# EAGLE design DUT-28bit-preCounter (EAGLE 5.07)
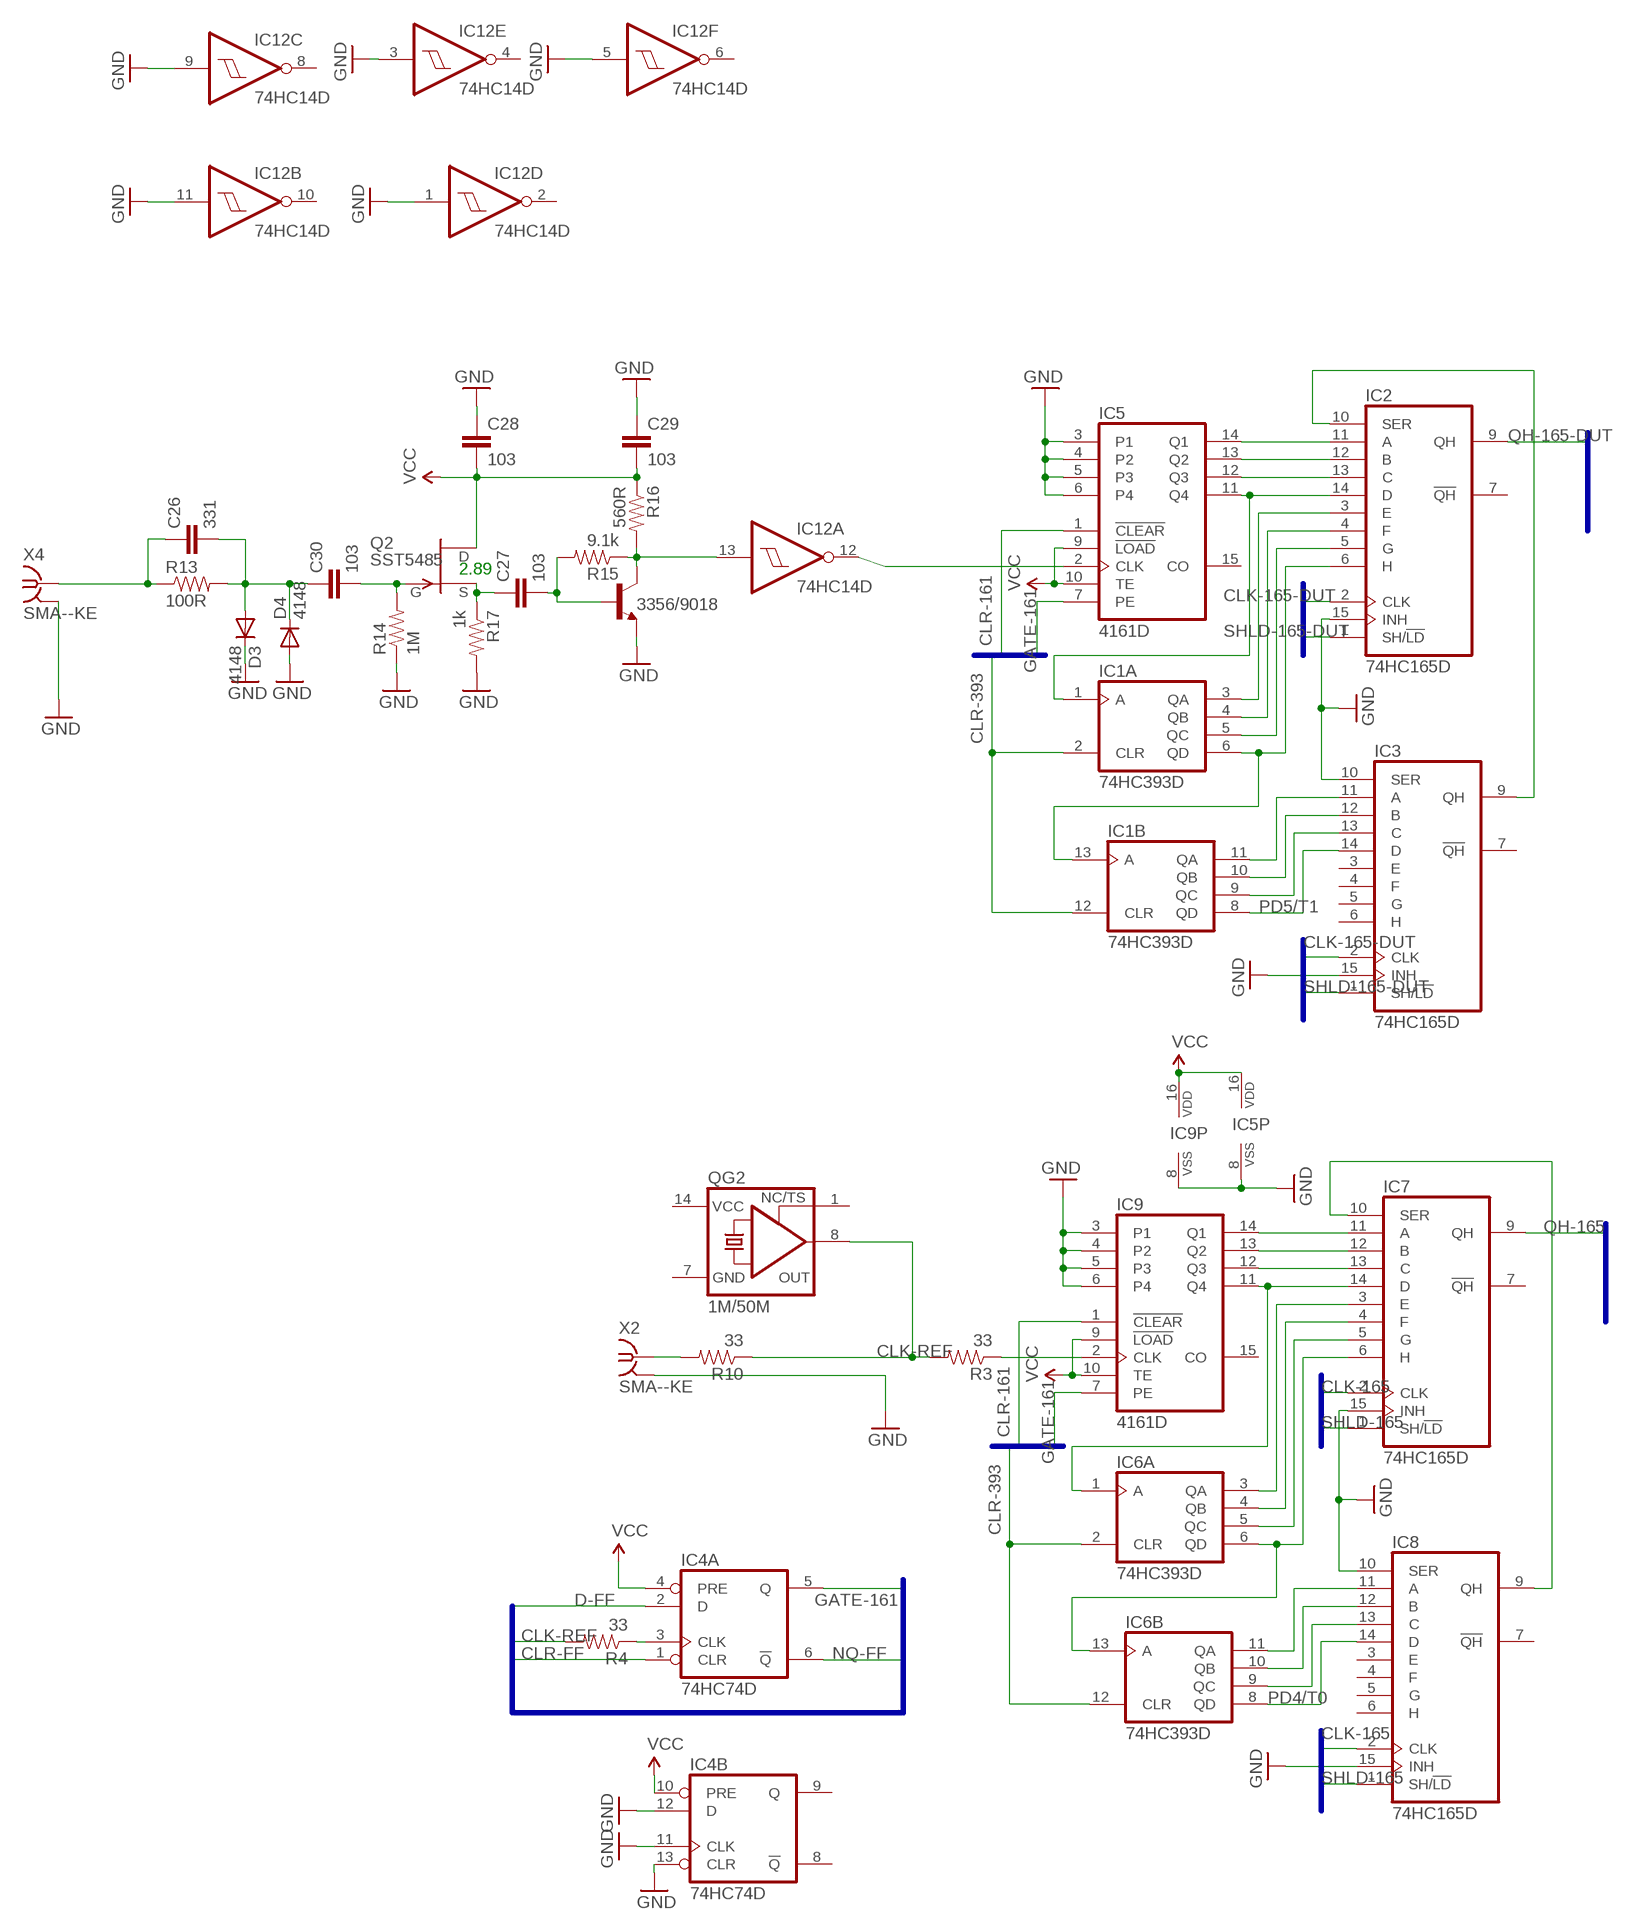
[diagram p0: schematic, sheet 1, part 1 of 2]
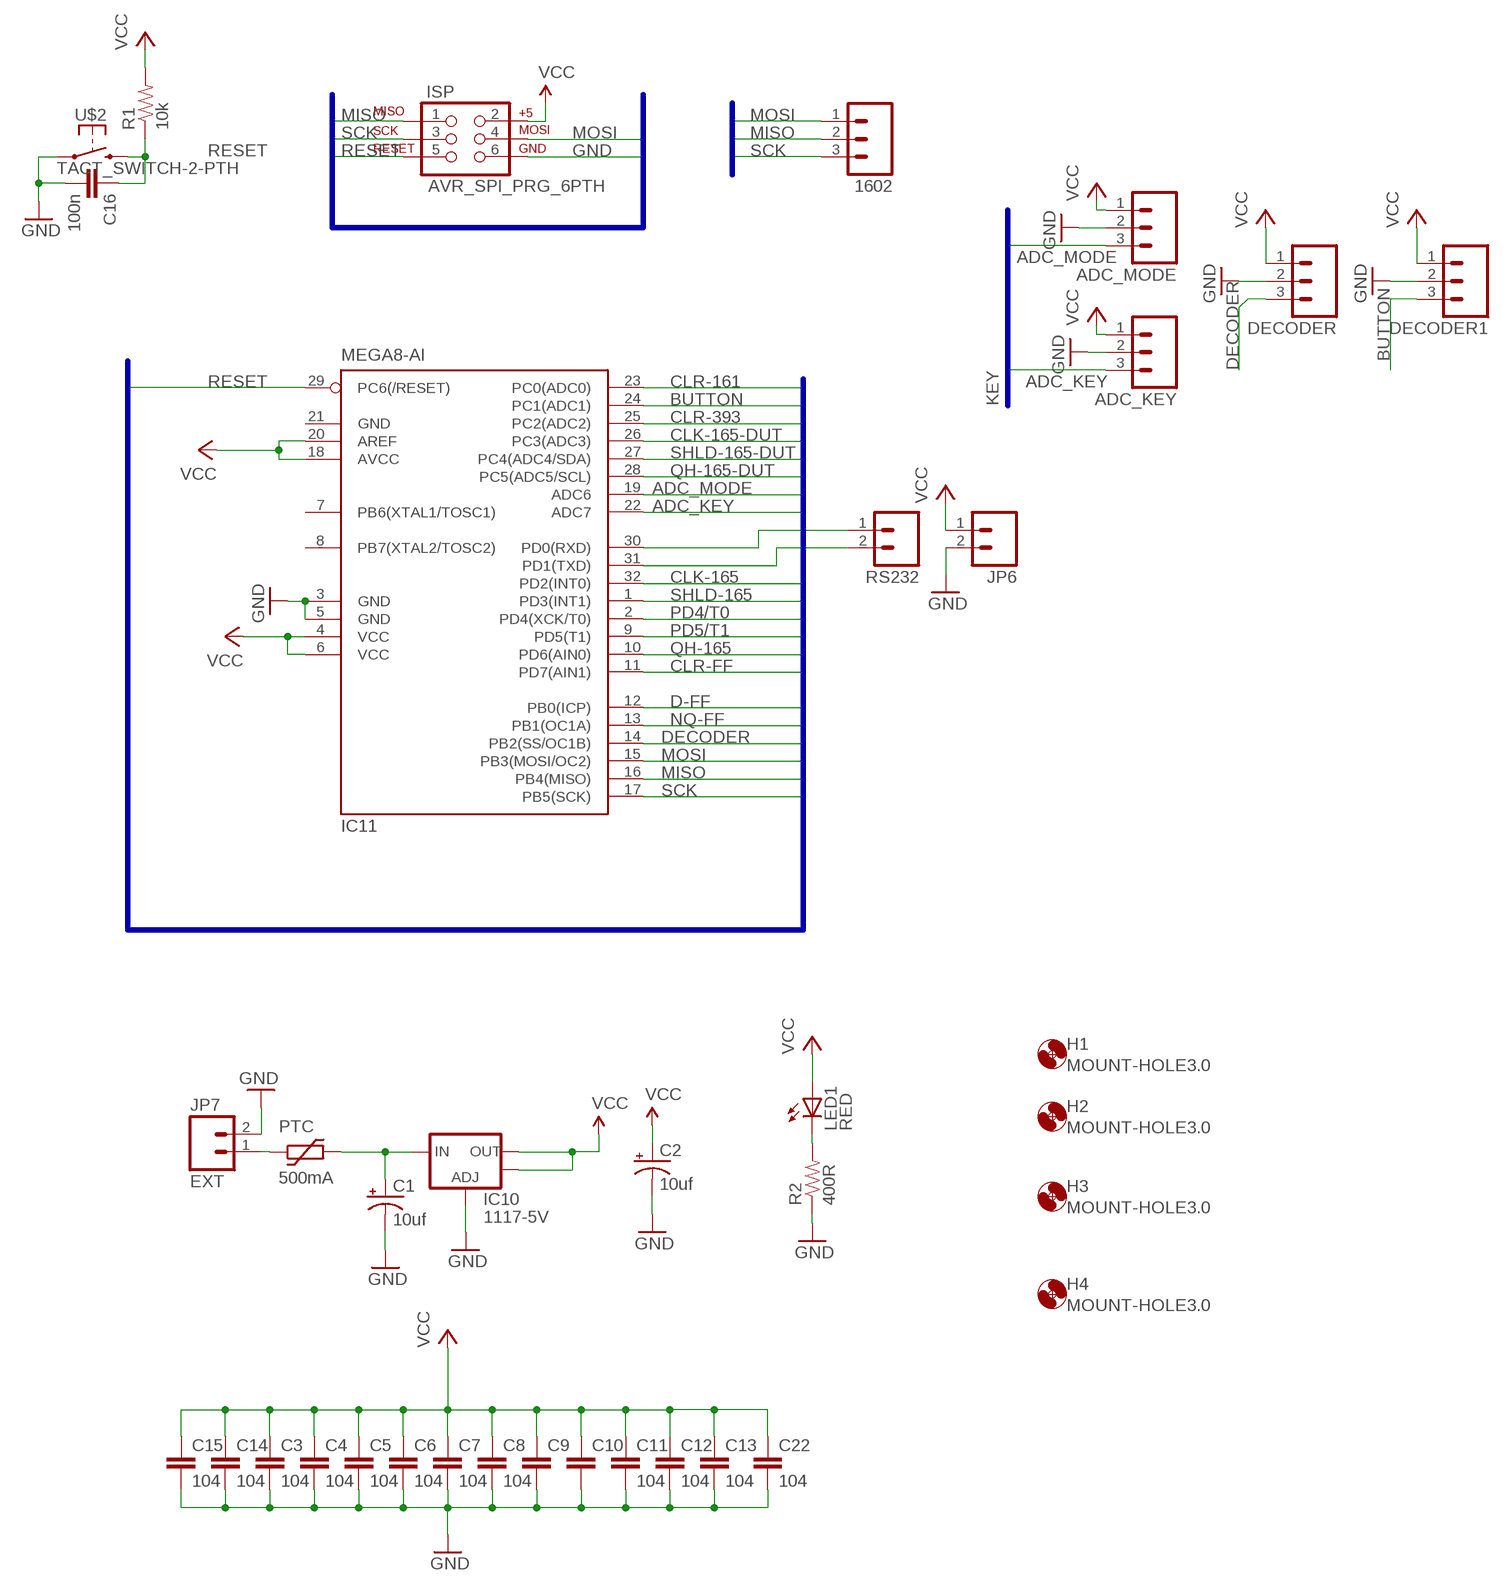
[diagram p1: schematic, sheet 1, part 2 of 2]

## Parts
1602  M03LOCK_LONGPADS  [1X03_LOCK_LONGPADS]
3356/9018  -NPN-SOT23-BEC  [SOT23-BEC]
ADC_KEY  M03PTH  [1X03]
ADC_MODE  M03PTH  [1X03]
C1  10uf  CAP_POL7343  [EIA7343]
C2  10uf  CAP_POL7343  [EIA7343]
C3  104  CAP-C0805K  [C0805K]
C4  104  CAP-C0805K  [C0805K]
C5  104  CAP-C0805K  [C0805K]
C6  104  CAP-C0805K  [C0805K]
C7  104  CAP-C0805K  [C0805K]
C8  104  CAP-C0805K  [C0805K]
C9  CAP-C0805K  [C0805K]
C10  CAP-C0805K  [C0805K]
C11  104  CAP-C0805K  [C0805K]
C12  104  CAP-C0805K  [C0805K]
C13  104  CAP-C0805K  [C0805K]
C14  104  CAP-C0805K  [C0805K]
C15  104  CAP-C0805K  [C0805K]
C16  100n  CAP-C0805K  [C0805K]
C22  104  CAP-C0805K  [C0805K]
C26  331  CAP-C0805  [C0805]
C27  103  CAP-C0805  [C0805]
C28  103  CAP-C0805  [C0805]
C29  103  CAP-C0805  [C0805]
C30  103  CAP-C0805  [C0805]
D3  4148  DIODE1206  [1206-DIODE]
D4  4148  DIODE1206  [1206-DIODE]
DECODER  M03PTH  [1X03]
DECODER1  M03PTH  [1X03]
H1  MOUNT-HOLE3.0  [3,0]
H2  MOUNT-HOLE3.0  [3,0]
H3  MOUNT-HOLE3.0  [3,0]
H4  MOUNT-HOLE3.0  [3,0]
IC1  74HC393D  [SO14]
IC2  74HC165D  [SO16]
IC3  74HC165D  [SO16]
IC4  74HC74D  [SO14]
IC5  4161D  [SO16]
IC6  74HC393D  [SO14]
IC7  74HC165D  [SO16]
IC8  74HC165D  [SO16]
IC9  4161D  [SO16]
IC10  1117-5V  V_REG_LM1117SOT223  [SOT223]
IC11  MEGA8-AI  [TQFP32-08]
IC12  74HC14D  [SO14]
ISP  AVR_SPI_PRG_6PTH  [2X3]
JP6  CON-02PTH  [1X02]
JP7  EXT  CON-02-XH  [XH-1X2-LONG-LOCK]
LED1  RED  LEDCHIP-LED0805  [CHIP-LED0805]
PTC  500mA  PTC-FUSE1812L  [1812L]
Q2  SST5485  [SOT23]
QG2  1M/50M  XO-14  [DIL14S]
R1  10k  RESISTOR0805  [0805]
R2  400R  RESISTOR0805  [0805]
R3  33  RESISTOR0805  [0805]
R4  33  RESISTOR0805  [0805]
R10  33  RESISTOR0805  [0805]
R13  100R  RESISTOR0805  [0805]
R14  1M  RESISTOR-R0805W  [R0805W]
R15  9.1k  RESISTOR0805  [0805]
R16  560R  RESISTOR-R0805W  [R0805W]
R17  1k  RESISTOR-R0805W  [R0805W]
RS232  CON-02PTH  [1X02]
U$2  TACT_SWITCH-2-PTH  [ALPS-SKHV]
X2  SMA--KE  [SMA-KE]
X4  SMA--KE  [SMA-KE]

## Nets
ADC_KEY: ADC_KEY.3 IC11.22(ADC7)
ADC_MODE: ADC_MODE.3 IC11.19(ADC6)
BUTTON: DECODER1.3 IC11.24(PC1(ADC1))
CLK-165: IC7.2(CLK) IC8.2(CLK) IC11.32(PD2(INT0))
CLK-165-DUT: IC2.2(CLK) IC3.2(CLK) IC11.26(PC3(ADC3))
CLK-REF: QG2.8(OUT) R3.2 R4.2 R10.1
CLR-161: IC5.1(!CLEAR) IC9.1(!CLEAR) IC11.23(PC0(ADC0))
CLR-393: IC1.2(A:CLR) IC1.12(B:CLR) IC6.2(A:CLR) IC6.12(B:CLR) IC11.25(PC2(ADC2))
CLR-FF: IC4.1(A:CLR) IC11.11(PD7(AIN1))
D-FF: IC4.2(A:D) IC11.12(PB0(ICP))
DECODER: DECODER.3 IC11.14(PB2(SS/OC1B))
GATE-161: IC4.5(A:Q) IC5.7(PE) IC9.7(PE)
GND: 3356/9018.E ADC_KEY.2 ADC_MODE.2 C1.C(-) C2.C(-) C3.2 C4.2 C5.2 C6.2 C7.2 C8.2 C9.2 C10.2 C11.2 C12.2 C13.2 C14.2 C15.2 C16.2 C22.2 C28.1 C29.1 D3.K(C) D4.A DECODER1.2 DECODER.2 IC2.15(INH) IC3.10(SER) IC3.15(INH) IC4.11(B:CLK) IC4.12(B:D) IC4.13(B:CLR) IC5.3(P1) IC5.4(P2) IC5.5(P3) IC5.6(P4) IC5.8(VSS) IC7.15(INH) IC8.10(SER) IC8.15(INH) IC9.3(P1) IC9.4(P2) IC9.5(P3) IC9.6(P4) IC9.8(VSS) IC10.1(ADJ) IC11.3(GND) IC11.5(GND) IC12.1(D:I) IC12.3(E:I) IC12.5(F:I) IC12.9(C:I) IC12.11(B:I) ISP.6 JP6.2 JP7.2 R2.1 R14.1 R17.2 U$2.2 X2.G@1(GND) X4.G@1(GND)
MISO: 1602.2 IC11.16(PB4(MISO)) ISP.1
MOSI: 1602.1 IC11.15(PB3(MOSI/OC2)) ISP.4
N$1: IC2.11(A) IC5.14(Q1)
N$2: IC2.12(B) IC5.13(Q2)
N$3: IC2.13(C) IC5.12(Q3)
N$4: JP7.1 PTC.P$1
N$5: IC1.3(A:QA) IC2.3(E)
N$6: IC1.4(A:QB) IC2.4(F)
N$7: IC1.5(A:QC) IC2.5(G)
N$8: IC1.6(A:QD) IC1.13(B:A) IC2.6(H)
N$9: IC1.1(A:A) IC2.14(D) IC5.11(Q4)
N$10: IC1.11(B:QA) IC3.11(A)
N$11: IC1.10(B:QB) IC3.12(B)
N$12: IC1.9(B:QC) IC3.13(C)
N$13: IC11.30(PD0(RXD)) RS232.1
N$14: C1.A(+) IC10.3(IN) PTC.P$2
N$15: IC2.10(SER) IC3.9(QH)
N$16: IC7.11(A) IC9.14(Q1)
N$17: IC7.12(B) IC9.13(Q2)
N$18: IC7.13(C) IC9.12(Q3)
N$19: R10.2 X2.1
N$20: IC6.3(A:QA) IC7.3(E)
N$21: IC6.4(A:QB) IC7.4(F)
N$22: IC6.5(A:QC) IC7.5(G)
N$23: IC6.6(A:QD) IC6.13(B:A) IC7.6(H)
N$24: IC6.11(B:QA) IC8.11(A)
N$25: IC6.10(B:QB) IC8.12(B)
N$26: IC6.9(B:QC) IC8.13(C)
N$27: IC11.31(PD1(TXD)) RS232.2
N$28: IC6.1(A:A) IC7.14(D) IC9.11(Q4)
N$29: IC4.3(A:CLK) R4.1
N$30: IC7.10(SER) IC8.9(QH)
N$31: IC9.2(CLK) R3.1
N$32: LED1.C R2.2
N$38: IC5.2(CLK) IC12.12(A:O)
N$41: C26.1 R13.1 X4.1
N$42: C26.2 C30.1 D3.A D4.K(C) R13.2
N$43: C27.1 Q2.2(S) R17.1
N$44: 3356/9018.B C27.2 R15.2
N$45: 3356/9018.C IC12.13(A:I) R15.1 R16.2
N$46: C30.2 Q2.3(G) R14.2
NQ-FF: IC4.6(A:!Q) IC11.13(PB1(OC1A))
PD4/T0: IC6.8(B:QD) IC8.14(D) IC11.2(PD4(XCK/T0))
PD5/T1: IC1.8(B:QD) IC3.14(D) IC11.9(PD5(T1))
QH-165: IC7.9(QH) IC11.10(PD6(AIN0))
QH-165-DUT: IC2.9(QH) IC11.28(PC5(ADC5/SCL))
RESET: C16.1 IC11.29(PC6(/RESET)) ISP.5 R1.1 U$2.3
SCK: 1602.3 IC11.17(PB5(SCK)) ISP.3
SHLD-165: IC7.1(SH/!LD) IC8.1(SH/!LD) IC11.1(PD3(INT1))
SHLD-165-DUT: IC2.1(SH/!LD) IC3.1(SH/!LD) IC11.27(PC4(ADC4/SDA))
VCC: ADC_KEY.1 ADC_MODE.1 C2.A(+) C3.1 C4.1 C5.1 C6.1 C7.1 C8.1 C9.1 C10.1 C11.1 C12.1 C13.1 C14.1 C15.1 C22.1 C28.2 C29.2 DECODER1.1 DECODER.1 IC4.4(A:PRE) IC4.10(B:PRE) IC5.9(!LOAD) IC5.10(TE) IC5.16(VDD) IC9.9(!LOAD) IC9.10(TE) IC9.16(VDD) IC10.2(OUT) IC10.4(OUT) IC11.4(VCC) IC11.6(VCC) IC11.18(AVCC) IC11.20(AREF) ISP.2 JP6.1 LED1.A Q2.1(D) R1.2 R16.1
Unconnected: IC2.7(!QH) IC3.3(E) IC3.4(F) IC3.5(G) IC3.6(H) IC3.7(!QH) IC4.8(B:!Q) IC4.9(B:Q) IC5.15(CO) IC7.7(!QH) IC8.3(E) IC8.4(F) IC8.5(G) IC8.6(H) IC8.7(!QH) IC9.15(CO) IC11.7(PB6(XTAL1/TOSC1)) IC11.8(PB7(XTAL2/TOSC2)) IC12.2(D:O) IC12.4(E:O) IC12.6(F:O) IC12.8(C:O) IC12.10(B:O) QG2.1(TS)

## Buses
MEGA-BUS
KEY

## Notes on the sheet
- 2.89

## Power pins joined to a net without a drawn wire
GND: IC1.7(P:GND) IC2.8(GND) IC3.8(GND) IC4.7(P:GND) IC6.7(P:GND) IC7.8(GND) IC8.8(GND) IC11.21(GND) IC12.7(P:GND) QG2.7(GND) X2.G@2(GND) X2.G@3(GND) X2.G@4(GND) X4.G@2(GND) X4.G@3(GND) X4.G@4(GND)
VCC: IC1.14(P:VCC) IC2.16(VCC) IC3.16(VCC) IC4.14(P:VCC) IC6.14(P:VCC) IC7.16(VCC) IC8.16(VCC) IC12.14(P:VCC) QG2.14(VCC)

## Library data of the parts
1602 ADC_KEY ADC_MODE DECODER DECODER1 = SparkFun:M03: Header 3 Standard 3-pin 0.1" header. Use with straight break away headers (SKU : PRT-00116), right angle break away headers (PRT-00553), swiss pins (PRT-00743), machine pins (PRT-00117), and female headers (PRT-00115). Molex polarized connector foot print use with SKU : PRT-08232 with associated crimp pins and housings.
3356/9018 = digital-toy:*-NPN-: NPN Transistror most of sot-23 use the pacages sot23-BEC, top C, left B, right E. by hyl, digital-toy. and to-92 use ebc(from-top) by hyl, digital-toy.
C1 C2 = digital-toy:CAP_POL: Capacitor Polarized These are standard SMD and PTH capacitors. Normally 10uF, 47uF, and 100uF in electrolytic and tantalum varieties. Always verify the external diameter of the through hole cap, it varies with capacity, voltage, and manufacturer. The EIA devices should be standard. PANASONIC_D size: 6.5mmx6.5mmx5.5mm, 100uf (taobao:6.3mmx5.5mm), same as CVL0605 153cvl0405 size: 4mmx4mmx5.5mm, 10uf (taobao:4mmx5.5mm) ct6032 typical 47uF Tantalum, comment by hyl.
C3-C16 C22 C26-C30 = digital-toy:CAP: Capacitor Standard 0603 ceramic capacitor, and 0.1" leaded capacitor.
D3 D4 = digital-toy:DIODE: Diode These are standard reverse protection diodes and small signal diodes. SMA package can handle up to about 1A. SOD-323 can handle about 200mA. What the SOD-323 package when ordering, there are some mfgs out there that are 5-pin packages.
H1-H4 = holes:MOUNT-HOLE: MOUNTING HOLE with drill center marker
IC1 IC6 = 74xx-eu:74*393: Dual 4-bit decade and binary COUNTER
IC2 IC3 IC7 IC8 = 74xx-eu:74*165: 8-bit parallel load SHIFT REGISTER
IC4 = 74xx-eu:74*74: Dual D type positive edge triggered FLIP FLOP, preset and clear
IC5 IC9 = 40xx:4161: Synchronous presettable 4-bit binary COUNTER
IC10 = SparkFun:V_REG_LM1117: Voltage Regulator LM1117 Standard adjustable voltage regulator but in SMD form. Spark Fun Electronics SKU : COM-00595
IC11 = atmel:MEGA8: MICROCONTROLLER 8 Kbytes FLASH, 1 kbytes SRAM, 512 bytes EEPROM, USART, 6-channel 10 bit ADC, 2-channel 8 bit ADC Pin compatible with Atmega48, ATMega88, ATMega168 Source: avr.lbr
IC12 = 74xx-eu:74*14: Hex schmitt trigger INVERTER
ISP = SparkFun:AVR_SPI_PRG_6: AVR ISP 6 Pin This is the reduced ISP connector for AVR programming. Common on Arduino. This footprint will take up less PCB space and can be used with a 10-pin to 6-pin adapter such as SKU: BOB-08508
JP6 JP7 RS232 = digital-toy:CON-02: Header 2 Standard 2-pin 0.1" header. Use with straight break away headers (SKU : PRT-00116), right angle break away headers (PRT-00553), swiss pins (PRT-00743), machine pins (PRT-00117), and female headers (PRT-00115). Molex polarized connector foot print use with SKU : PRT-08233 with associated crimp pins and housings.
LED1 = led:LED: LED OSRAM: - CHIPLED LG R971, LG N971, LY N971, LG Q971, LY Q971, LO R971, LY R971 LH N974, LH R974 LS Q976, LO Q976, LY Q976 LO Q996 - Hyper CHIPLED LW Q18S LB Q993, LB Q99A, LB R99A - SideLED LS A670, LO A670, LY A670, LG A670, LP A670 LB A673, LV A673, LT A673, LW A673 LH A674 LY A675 LS A676, LA A676, LO A676, LY A676, LW A676 LS A679, LY A679, LG A679 - Hyper Micro SIDELED® LS Y876, LA Y876, LO Y876, LY Y876 LT Y87S - SmartLED LW L88C, LW L88S LB L89C, LB L89S, LG L890 LS L89K, LO L89K, LY L89K LS L896, LA L896, LO L896, LY L896 - TOPLED LS T670, LO T670, LY T670, LG T670, LP T670 LSG T670, LSP T670, LSY T670, LOP T670, LYG T670 LG T671, LOG T671, LSG T671 LB T673, LV T673, LT T673, LW T673 LH T674 LS T676, LA T676, LO T676, LY T676, LB T676, LH T676, LSB T676, LW T676 LB T67C, LV T67C, LT T67C, LS T67K, LO T67K, LY T67K, LW E67C LS E67B, LA E67B, LO E67B, LY E67B, LB E67C, LV E67C, LT E67C LW T67C LS T679, LY T679, LG T679 LS T770, LO T770, LY T770, LG T770, LP T770 LB T773, LV T773, LT T773, LW T773 LH T774 LS E675, LA E675, LY E675, LS T675 LS T776, LA T776, LO T776, LY T776, LB T776 LHGB T686 LT T68C, LB T68C - Hyper Mini TOPLED® LB M676 - Mini TOPLED Santana® LG M470 LS M47K, LO M47K, LY M47K Source: http://www.osram.convergy.de LUXEON: - LUMILED® LXK2-PW12-R00, LXK2-PW12-S00, LXK2-PW14-U00, LXK2-PW14-V00 LXK2-PM12-R00, LXK2-PM12-S00, LXK2-PM14-U00 LXK2-PE12-Q00, LXK2-PE12-R00, LXK2-PE12-S00, LXK2-PE14-T00, LXK2-PE14-U00 LXK2-PB12-K00, LXK2-PB12-L00, LXK2-PB12-M00, LXK2-PB14-N00, LXK2-PB14-P00, LXK2-PB14-Q00 LXK2-PR12-L00, LXK2-PR12-M00, LXK2-PR14-Q00, LXK2-PR14-R00 LXK2-PD12-Q00, LXK2-PD12-R00, LXK2-PD12-S00 LXK2-PH12-R00, LXK2-PH12-S00 LXK2-PL12-P00, LXK2-PL12-Q00, LXK2-PL12-R00 Source: www.luxeon.com KINGBRIGHT: KA-3528ASYC Source: www.kingbright.com
PTC = digital-toy:PTC-FUSE
Q2 = transistor-fet:?548*: N-Channel JFETs Source: VISHAY 2N5484.pdf Compatible: TO92 2N5245 J304 J305 U310 J308 J309 J310 TO72 2N4416 2N4416A 2N3823 2N4351 3N169 3N170 3N171 MFE3002 TO18 2N3796 2N3797 MFE825 Source: Motorola European Master Guide Pacge 3-59
QG2 = digital-toy:XO-: CRYSTAL
R1-R4 R10 R13-R17 = digital-toy:RESISTOR: Resistor Basic schematic elements and footprints for 0603, 1206, and PTH 1/10th watt (small) resistors. digital-toy copy vertical mount of axial-0.3 from rcl.lbr : the 0207/xx
U$2 = digital-toy:TACT_SWITCH-2
X2 X4 = dtoy-RF:SMA-: SMA 50 Ohm End Launch Jack Receptacle - Round Contact Johnson Components Source: www.johnsoncomponents.com .. J502-ND.pdf

## Board
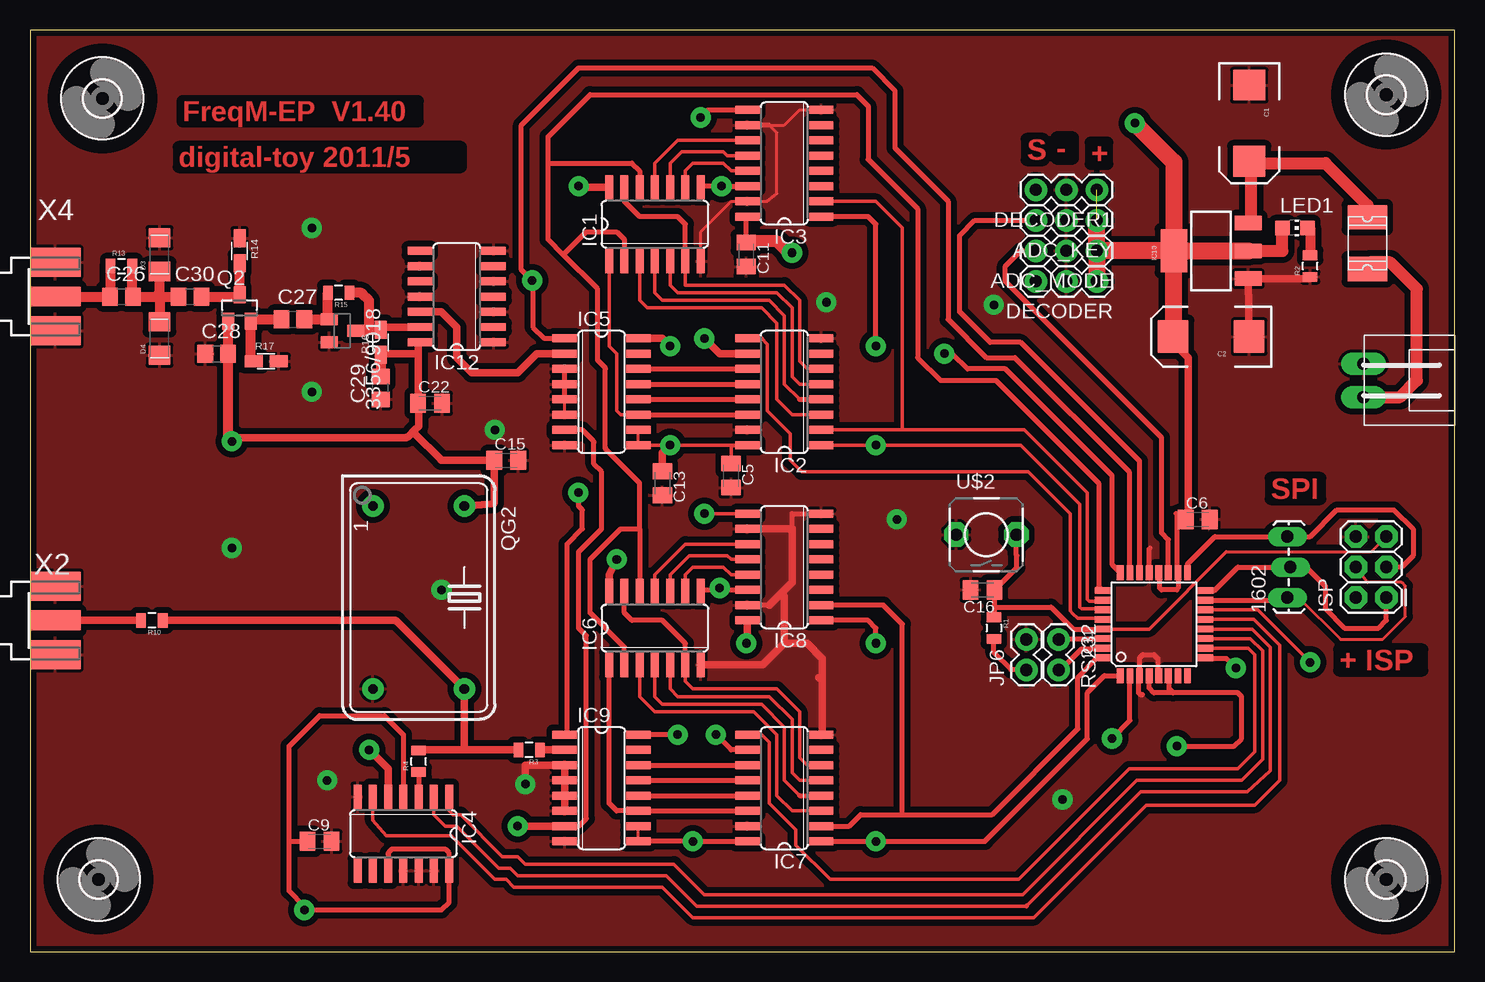
[diagram p2: board, top side]
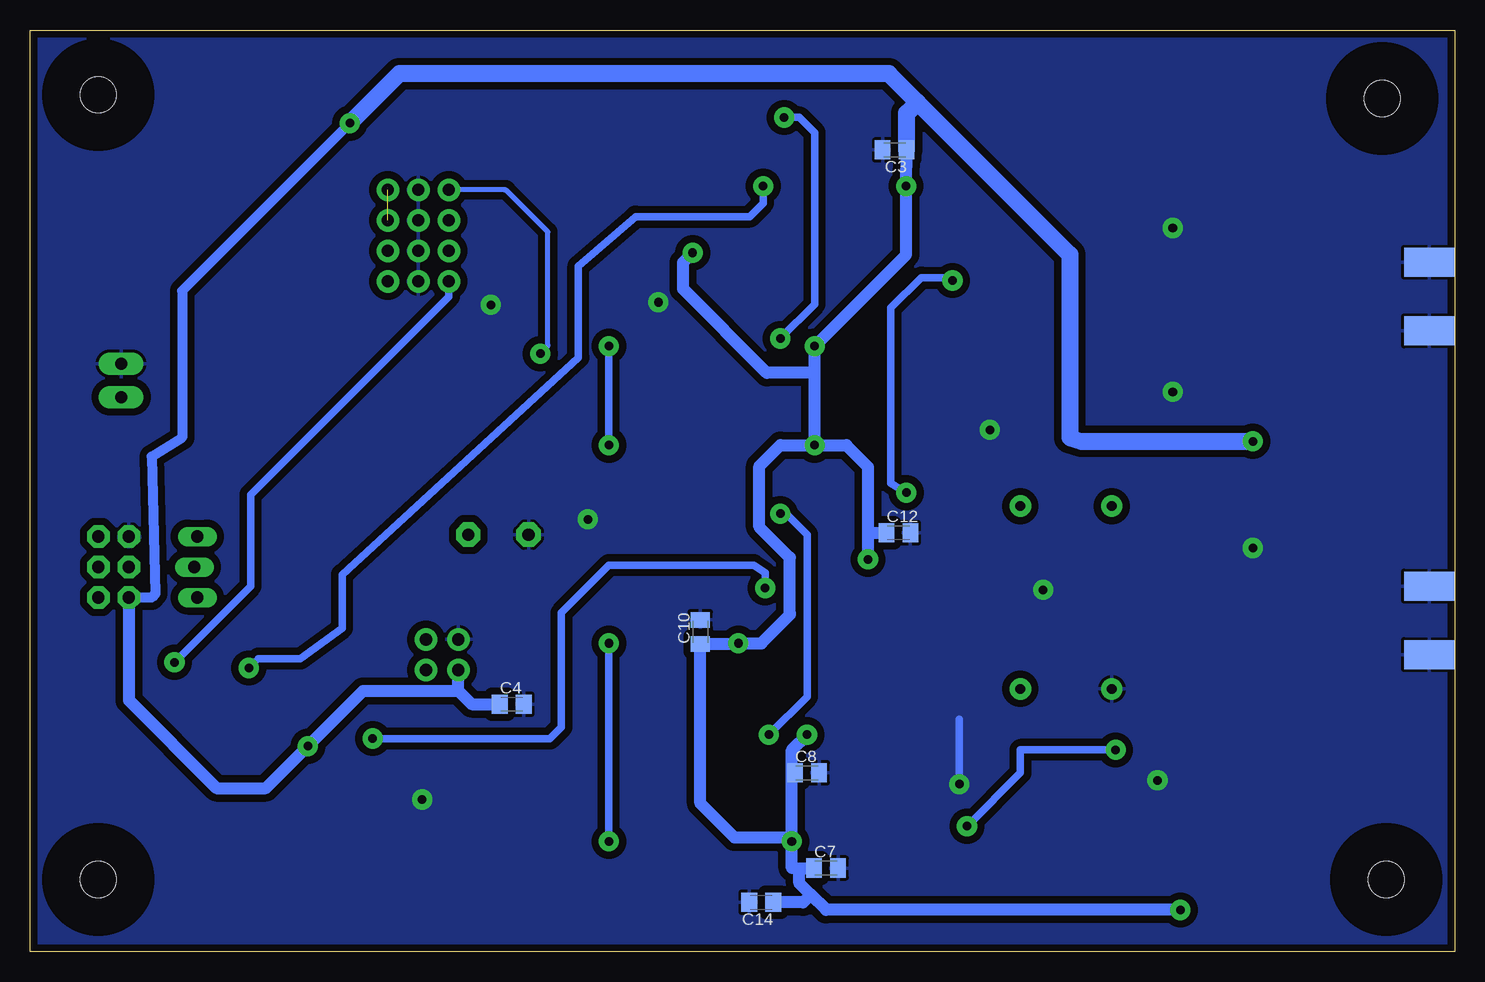
[diagram p3: board, bottom side, seen from below]

Size 118.72 x 76.82 mm. Coordinates in mm from the lower left corner, seen from the top.
Outline: 0,0 118.72,0 118.72,76.82 0,76.82 0,0
Copper layers (1*16): Top 0.035mm / dielectric 1.5mm / Bottom 0.035mm
Design rules "SparkFun": minimum track width 8mil, minimum drill 20mil, track to track 8mil, track to pad 8mil, pad to pad 8mil, via to via 8mil, smd to smd 8mil, copper to edge 10mil, drill to drill 8mil, minimum pad ring 12mil, minimum via ring 10mil, stop-mask expansion 4mil, vias tented up to drill 25mil, thermal gap 10mil

### Footprints (pad centres in the part's own frame; a part is rotated, then mirrored left to right if it is on the bottom)
1X03_LOCK_LONGPADS = drill 1.016 long: 1 0,0; 2 2.54,-0.254; 3 5.08,0
SOT23-BEC = smd 1 x 1.4: B -0.95,-1.1; C 0,1.1; E 0.95,-1.1
1X03 = drill 1.016 pad 1.88 round: 1 0,0; 2 2.54,0; 3 5.08,0
EIA7343 = smd 2.55 x 2.7: A 3.17,0; C -3.17,0
C0805K = smd 1.3 x 1.6: 1 -1,0; 2 1,0
C0805 = smd 1.3 x 1.5: 1 -0.95,0; 2 0.95,0
1206-DIODE = smd 1.6 x 1.8: A -1.4,0; K 1.4,0
3,0 = hole 3: 0,0
SO14 = smd 0.66 x 2.032: 1 -3.81,-3.073; 2 -2.54,-3.073; 3 -1.27,-3.073; 4 0,-3.073; 5 1.27,-3.073; 6 2.54,-3.073; 7 3.81,-3.073; 8 3.81,3.073; 9 2.54,3.073; 10 1.27,3.073; 11 0,3.073; 12 -1.27,3.073; 13 -2.54,3.073; 14 -3.81,3.073
SO16 = smd 0.66 x 2.032: 1 -4.445,-3.073; 2 -3.175,-3.073; 3 -1.905,-3.073; 4 -0.635,-3.073; 5 0.635,-3.073; 6 1.905,-3.073; 7 3.175,-3.073; 8 4.445,-3.073; 9 4.445,3.073; 10 3.175,3.073; 11 1.905,3.073; 12 0.635,3.073; 13 -0.635,3.073; 14 -1.905,3.073; 15 -3.175,3.073; 16 -4.445,3.073
SOT223 = smd 1.219 x 2.235: 1 -2.311,-3.099; 2 0,-3.099; 3 2.311,-3.099 | smd 3.6 x 2.2: 4 0,3.099
TQFP32-08 = smd 1.27 x 0.559: 1 -4.293,2.8; 2 -4.293,2; 3 -4.293,1.2; 4 -4.293,0.4; 5 -4.293,-0.4; 6 -4.293,-1.2; 7 -4.293,-2; 8 -4.293,-2.8; 17 4.293,-2.8; 18 4.293,-2; 19 4.293,-1.2; 20 4.293,-0.4; 21 4.293,0.4; 22 4.293,1.2; 23 4.293,2; 24 4.293,2.8 | smd 0.559 x 1.27: 9 -2.8,-4.293; 10 -2,-4.293; 11 -1.2,-4.293; 12 -0.4,-4.293; 13 0.4,-4.293; 14 1.2,-4.293; 15 2,-4.293; 16 2.8,-4.293; 25 2.8,4.293; 26 2,4.293; 27 1.2,4.293; 28 0.4,4.293; 29 -0.4,4.293; 30 -1.2,4.293; 31 -2,4.293; 32 -2.8,4.293
2X3 = drill 1.016 pad 1.88 octagon: 1 0,0; 2 0,2.54; 3 2.54,0; 4 2.54,2.54; 5 5.08,0; 6 5.08,2.54
1X02 = drill 1.016 pad 1.88 round: 1 0,0; 2 2.54,0
XH-1X2-LONG-LOCK = drill 1.016 pad 1.88 long: 1 1.397,0; 2 -1.397,0
CHIP-LED0805 = smd 1.2 x 1.2: A 0,-1.05; C 0,1.05
1812L = smd 2.03 x 3.3: P$1 -2.16,0; P$2 2.16,0
SOT23 = smd 1 x 1.4: 1 -0.95,-1.1; 2 0.95,-1.1; 3 0,1.1
DIL14S = drill 0.813 pad 1.778 round: 1 -7.62,-3.81; 7 7.62,-3.81; 8 7.62,3.81; 14 -7.62,3.81
0805 = smd 0.8 x 1.2: 1 -0.9,0; 2 0.9,0
R0805W = smd 1.5 x 1: 1 -1.052,0; 2 1.052,0
ALPS-SKHV = drill 1.016 pad 2.032 octagon: 2 -2.51,0; 3 2.51,0
SMA-KE = smd 4.191 x 1.651: 1 2.115,0 | smd 4.191 x 2.413: G@1 2.115,2.86; G@2 2.115,-2.86 | smd 4.191 x 2.413 bottom: G@3 2.115,2.86; G@4 2.115,-2.86

### Placement (x,y rotation side)
1602  104.78,29.53 90 top
3356/9018  26.04,51.75 270 top
ADC_KEY  88.9,60.96 180 top
ADC_MODE  88.9,58.42 180 top
C1  101.6,69.06 270 top
C2  98.43,51.28 180 top
C3  46.67,66.83 180 bottom
C4  78.58,20.64 0 bottom
C5  58.42,39.69 270 top
C6  97.31,36.04 0 top
C7  52.39,6.99 0 bottom
C8  53.98,14.92 0 bottom
C9  24.13,9.21 0 top
C10  62.87,26.67 90 bottom
C11  59.69,58.1 270 top
C12  46.35,34.92 0 bottom
C13  52.7,39.05 270 top
C14  57.78,4.13 180 bottom
C15  39.69,40.96 0 top
C16  79.38,30.16 180 top
C22  33.34,45.72 0 top
C26  7.62,54.61 0 top
C27  21.91,52.7 0 top
C28  15.56,49.85 0 top
C29  29.21,46.99 90 top
C30  13.34,54.61 0 top
D3  10.79,58.1 90 top
D4  10.79,51.12 90 top
DECODER  88.9,55.88 180 top
DECODER1  88.9,63.5 180 top
H1  6.03,71.12 0 top
H2  113.03,6.03 0 top
H3  113.03,71.44 0 top
H4  5.71,6.03 0 top
IC1  52.07,60.64 0 top
IC2  62.87,46.67 90 top
IC3  62.87,65.72 90 top
IC4  31.11,9.84 180 top
IC5  47.62,46.67 270 top
IC6  52.07,26.99 0 top
IC7  62.87,13.65 90 top
IC8  62.87,32.07 90 top
IC9  47.62,13.65 270 top
IC10  98.42,58.42 90 top
IC11  93.66,27.3 90 top
IC12  35.56,54.61 90 top
ISP  113.03,29.53 90 top
JP6  83.03,23.5 90 top
JP7  111.12,47.62 270 top
LED1  105.41,60.33 270 top
PTC  111.44,59.05 90 top
Q2  17.46,53.66 0 top
QG2  32.38,29.53 270 top
R1  80.33,26.99 270 top
R2  106.68,57.15 90 top
R3  41.59,16.83 180 top
R4  32.38,15.88 90 top
R10  10.16,27.62 180 top
R13  7.62,57.15 0 top
R14  17.46,58.42 270 top
R15  25.72,54.93 180 top
R16  29.21,50.8 90 top
R17  19.68,49.21 0 top
RS232  85.72,26.04 270 top
U$2  79.69,34.77 0 top
X2  0,27.62 0 top
X4  0,54.61 0 top

### Tracks (layer width: path | path; a pad name or v marks a point on that pad's centre or on a via)
ADC_KEY
  Top 0.406: IC11.22 92.46,40.89 82.55,50.8 80.01,50.8 77.47,53.34 77.47,59.69 78.74,60.96 ADC_KEY.3
ADC_MODE
  Top 0.406: IC11.19 94.86,34.36 94.3,34.92 94.3,42.86 81.28,55.88 81.28,57.15 82.55,58.42 ADC_MODE.3
BUTTON  (via drill 0.71 pad 1.68)
  Top 0.406: IC11.24 90.24,32.22 arc-45 90.17,32.4 90.17,39.69 81.28,48.58 78.11,48.58 76.91,49.77 arc45 76.73,49.85 v76.2,49.85
  Bottom 0.406: DECODER1.3 79.16,63.5 arc45 78.98,63.43 75.56,60.01 75.56,50.59 arc45 75.64,50.41 v76.2,49.85
CLK-165
  Top 0.406: IC8.2 71.12,28.89 72.71,27.3 72.71,11.43 | IC7.2 68.26,10.48 69.22,11.43 72.71,11.43 | IC11.32 88.96,24.5 87.31,22.86 87.31,18.57 80.17,11.43 72.71,11.43
CLK-165-DUT
  Top 0.254: 89.28,29.21 IC11.26
  Top 0.305: IC3.2 70.48,62.55 72.71,60.33 72.71,43.5 | 89.28,29.21 88.27,29.21 88.11,29.37 88.11,38.26 | IC2.2 72.71,43.5 | 88.11,38.26 | 88.11,38.26 82.87,43.5 72.71,43.5
CLK-REF
  Top 0.61: 36.2,16.83 32.51,16.83 arc45 R4.2 | 36.2,16.83 R3.2 | 36.2,16.83 QG2.8 30.55,27.55 arc45 30.38,27.62 R10.1
CLR-161  (via drill 0.71 pad 1.68)
  Top 0.254: IC9.1 44.55,18.2 | 45.72,38.24 v45.7,38.27
  Top 0.406: 44.55,18.2 44.77,18.1 44.77,33.97 46.04,35.24 46.04,36.83 45.72,37.15 45.72,38.24 | IC5.1 42.86,51.12 41.91,52.07 41.91,55.69 v41.85,55.94 40.96,56.83 40.96,68.9 45.72,73.66 70.17,73.66 72.07,71.75 72.07,66.99 76.52,62.55 76.52,52.7 79.69,49.53 82.07,49.53 91.6,40.01 91.6,31.66 IC11.23
  Bottom 0.406: 42.55,56.2 42.42,56.2
  Bottom 0.61: 42.55,56.2 44.45,56.2 46.99,53.66 46.99,39.05 v45.7,38.27 | 42.42,56.2 v41.85,55.94
CLR-393
  Top 0.406: 50.8,35.24 IC6.12 | 50.8,35.24 50.8,39.05 48.02,41.84 arc-45 47.94,42.02 47.94,48.58 arc45 47.87,48.76 47.31,49.32 47.31,55.24 44.45,58.1 | IC6.2 49.53,25.4 46.67,28.26 46.67,32.7 49.21,35.24 50.8,35.24 | 44.45,58.1 43.18,59.37 43.18,65.72 | 43.18,65.72 43.18,67.94 46.67,71.44 68.9,71.44 69.85,70.48 69.85,66.04 73.98,61.91 73.98,49.53 75.88,47.62 80.49,47.62 89.06,39.05 89.06,30.42 IC11.25 | IC1.12 50.8,65.09 50.16,65.72 43.18,65.72 | IC1.2 49.53,59.37 48.9,60.01 46.35,60.01 44.45,58.1
CLR-FF
  Top 0.305: IC11.11 101.69,26.11 102.71,25.08 102.71,16.03 100.97,14.29 92.23,14.29 82.71,4.76 56.2,4.76 53.66,7.3 41.27,7.3 40.64,7.94 39.37,7.94 35.88,11.43 35.24,11.43 34.92,11.75 IC4.1
D-FF
  Top 0.305: IC11.12 101.84,26.91 103.35,25.4 103.35,15.08 101.44,13.34 92.55,13.34 83.03,3.81 55.56,3.81 53.02,6.35 40.64,6.35 40.01,6.99 39.05,6.99 35.56,10.48 34.61,10.48 33.66,11.43 IC4.2
  Top 0.406: 83.03,3.81
DECODER  (via drill 0.71 pad 1.68)
  Top 0.305: IC11.14 102.31,28.5 v106.68,24.13
  Bottom 0.61: v106.68,24.13 100.33,30.48 100.33,38.1 83.82,54.61 DECODER.3
GATE-161  (via drill 0.71 pad 1.68)
  Top 0.406: IC9.7 45.72,10.48 46.35,11.11 46.35,26.35 45.72,26.99 45.72,33.34 47.62,35.24 47.62,40.01 46.99,40.64 46.99,42.44 arc45 46.92,42.62 46.04,43.5 IC5.7
  Top 0.61: v40.64,10.48 IC9.7 | IC4.5 29.84,15.24 v28.26,16.83
  Bottom 0.61: v40.64,10.48 36.2,14.92 36.2,16.83 v28.26,16.83
GND  (via drill 0.71 pad 1.68)
  Top 0.254: IC5.6 IC5.5 | IC1.7 55.88,60.01 58.42,62.55 IC3.15 61.44,62.55 62.23,63.18 62.23,68.26 61.59,68.9 | 101.52,55.98 IC10.1 | IC3.10 62.87,68.9 64.14,70.17 IC3.8
  Top 0.406: IC5.5 IC5.4 IC5.3 | 63.5,35.24 63.5,36.51 IC8.8 | 61.59,28.89 IC8.15 | 61.59,68.9 IC3.10 | 92.71,21.43 92.55,21.43 92.39,21.59 92.39,22.94 IC11.3 92.46,24.52 92.71,24.77 93.66,24.77 93.98,24.45 93.98,23.09 IC11.5 | IC11.21 93.26,33.57 93.34,33.66
  Top 0.61: IC8.10 63.5,35.24 63.5,30.8 62.55,29.84 | IC6.7 61.06,23.91 62.87,25.72 | IC7.8 66.04,18.1 66.04,22.86 | 66.04,22.86 66.04,24.45 64.77,25.72 62.87,25.72 | IC9.6 IC9.5 IC9.4 IC9.3 41.27,15.56 v41.27,13.97 | C2.C 101.52,55.98 | IC10.1 106.68,56.11 R2.1 | 66.04,22.86 65.72,22.86 | 62.55,29.84 61.59,28.89 | 62.87,25.72 62.87,29.53 arc90 62.55,29.84
  Bottom 0.61: v41.27,13.97 41.27,19.37
  other vias: 66.36,54.13 72.23,36.04 86.04,12.7 23.5,46.67 80.33,53.91 24.77,14.29 16.83,33.66 38.73,43.5 23.5,60.33 34.29,30.16
  pour Top (isolate 0.508): 3.81,83.5 121.92,80.33 126.52,78.42 135.41,15.88 123.83,-7.94 24.13,-7.94 -9.84,-4.76 -9.84,67.63
  pour Bottom (isolate 0.61): 5.71,82.23 120.65,84.14 147.32,58.1 144.46,-7.46 122.56,-4.13 33.66,-3.49 -3.17,-2.86 -3.17,72.71
MISO
  Top 0.406: IC11.16 98.69,30.11 100.65,32.07 1602.2 106.36,32.07 107.95,30.48 107.95,28.57 109.54,26.99 112.39,26.99 113.03,27.62 ISP.1
MOSI
  Top 0.254: 1602.1 105.73,29.53 109.22,26.04 112.71,26.04 114.62,27.94 114.62,30.48 114.3,30.8 111.44,30.8 ISP.4
  Top 0.406: IC11.15 104.55,29.3 1602.1
N$1
  Top 0.406: IC5.14 IC2.11
N$2
  Top 0.406: IC5.13 IC2.12
N$3
  Top 0.406: IC5.12 IC2.13
N$4
  Top 0.406: 111.63,57.47 PTC.P$1
  Top 1.016: JP7.1 114.17,46.23 115.57,47.62 115.57,55.24 113.35,57.47 111.63,57.47
N$5
  Top 0.305: IC2.3 63.5,44.77 62.23,46.04 62.23,52.39 60.96,53.66 51.44,53.66 50.8,54.29 IC1.3
N$6
  Top 0.305: IC1.4 52.07,54.93 52.7,54.29 61.59,54.29 62.87,53.02 62.87,47.31 64.14,46.04
  Top 0.406: 64.14,46.04 IC2.4
N$7
  Top 0.305: IC2.5 64.14,47.31 63.5,47.94 63.5,53.66 62.23,54.93 53.98,54.93 53.34,55.56 IC1.5
N$8
  Top 0.305: IC1.6 54.61,55.56 62.87,55.56 64.14,54.29 64.14,49.21 64.77,48.58 IC2.6
  Top 0.406: IC1.13 49.53,62.55 50.8,61.28 53.98,61.28 54.61,60.64 IC1.6
N$9
  Top 0.305: IC1.1 48.26,50.48 48.9,49.85 48.9,45.09 49.21,44.77 IC5.11
  Top 0.406: IC5.11 IC2.14
N$10
  Top 0.305: IC1.11 52.07,65.72 53.98,67.63 IC3.11
N$11
  Top 0.305: IC1.10 53.34,65.72 54.29,66.67 57.78,66.67 58.1,66.36 IC3.12
N$12
  Top 0.305: IC1.9 54.61,65.09 55.24,65.72 57.78,65.72 58.42,65.09 IC3.13
N$13
  Top 0.406: IC11.30 85.8,26.11 RS232.1
N$14
  Top 0.406: 101.76,65.72 C1.A | IC10.3 101.76,60.97
  Top 1.016: PTC.P$2 111.44,62.23 107.95,65.72 101.76,65.72 101.76,60.97
N$15  (via drill 0.71 pad 1.68)
  Top 0.406: IC3.9 56.52,70.17 v55.88,69.53
  Top 0.61: IC2.10 57.47,49.85 v56.2,51.12
  Bottom 0.61: v55.88,69.53 54.61,69.53 53.34,68.26 53.34,53.98 v56.2,51.12
N$16
  Top 0.406: IC9.14 IC7.11
N$17
  Top 0.406: IC9.13 IC7.12
N$18
  Top 0.406: IC9.12 IC7.13
N$19
  Top 0.61: X2.1 R10.2
N$20
  Top 0.305: IC6.3 50.8,21.27 52.07,20 60.33,20 62.23,18.1 62.23,13.02 63.5,11.75 IC7.3
N$21
  Top 0.305: 64.14,13.02 62.87,14.29 62.87,18.73 60.96,20.64 52.7,20.64 52.07,21.27 IC6.4
  Top 0.406: 64.14,13.02 IC7.4
N$22
  Top 0.305: IC6.5 53.34,21.91 53.98,21.27 61.59,21.27 63.5,19.37 63.5,14.92 64.14,14.29 IC7.5
N$23
  Top 0.305: IC6.6 54.61,22.54 55.24,21.91 62.23,21.91 64.14,20 64.14,16.19 64.77,15.56 IC7.6
  Top 0.406: IC6.13 49.53,28.26 50.16,27.62 52.7,27.62 54.61,25.72 IC6.6
N$24
  Top 0.305: IC6.11 52.07,31.43 54.61,33.97 IC8.11
N$25
  Top 0.305: IC6.10 53.34,31.43 54.93,33.02 58.1,33.02 58.42,32.7 IC8.12
N$26
  Top 0.305: IC6.9 54.61,31.43 55.24,32.07 57.78,32.07 58.42,31.43 IC8.13
N$27
  Top 0.406: RS232.2 85.88,23.5 87.63,25.24 89.31,25.24 IC11.31
N$28
  Top 0.406: IC7.14 IC9.11 48.9,11.75 48.26,12.38 IC6.1
N$29
  Top 0.406: R4.1 IC4.3
N$30  (via drill 0.71 pad 1.68)
  Top 0.305: v56.2,36.51 IC8.9
  Top 0.406: IC7.10 58.42,16.83 v57.15,18.1
  Bottom 0.61: v57.15,18.1 53.98,21.27 53.98,34.77 55.72,36.51 v56.2,36.51
N$31
  Top 0.61: R3.1 IC9.2
N$32
  Top 0.254: LED1.C 106.68,60.33
  Top 0.813: 106.68,60.33 R2.2
N$38
  Top 0.61: IC12.12 34.29,53.34 35.56,52.07 35.56,49.53 36.83,48.26 40.64,48.26 42.23,49.85 IC5.2
N$41
  Top 0.813: X4.1 C26.1 arc45 6.72,54.73 R13.1
N$42
  Top 0.813: C26.2 9.1,54.61 | C26.2 10.48,54.61 | 10.48,54.61 10.79,54.61 | 10.79,54.61 C30.1 | 10.79,54.61 D4.K | D3.A 10.79,55.03 arc-45 10.72,54.85 10.48,54.61 | R13.2 8.52,54.73 arc45 C26.2
N$43
  Top 0.813: R17.1 18.49,49.36 arc-45 18.41,49.54 Q2.2 18.49,52.63 arc-45 18.66,52.7 C27.1
N$44
  Top 0.813: C27.2 arc45 C27.2 3356/9018.B 24.89,52.75 arc-45 24.82,52.92 R15.2
N$45
  Top 0.61: IC12.13 29.53,52.07 arc45 29.35,52 R16.2
  Top 0.813: 3356/9018.C 27.16,51.78 arc-45 27.34,51.85 28.26,51.85 | 28.26,51.85 R16.2 | R15.1 27.52,54.93 arc-45 27.7,54.85 28.26,54.29 28.26,51.85
N$46
  Top 0.813: C30.2 17.21,54.61 arc45 17.39,54.68 Q2.3 R14.2
NQ-FF
  Top 0.305: IC4.6 28.57,10.95 29.69,9.68 35.08,9.68 38.73,6.03 39.69,6.03 40.32,5.4 52.7,5.4 55.24,2.86 83.66,2.86 93.03,12.22 102.08,12.22 104.14,14.29 104.14,25.56 101.99,27.7 IC11.13
PD4/T0  (via drill 0.71 pad 1.68)
  Top 0.254: IC6.8 55.98,30.16
  Top 0.406: 55.98,30.16 57.63,30.16 | 57.63,30.16 IC8.14 | 57.63,30.16 v57.47,30.32 | v90.17,17.78 91.66,19.27 IC11.2
  Bottom 0.61: v57.47,30.32 57.47,31.59 58.42,32.23 70.48,32.23 74.45,28.26 74.45,18.73 75.41,17.78 v90.17,17.78
PD5/T1  (via drill 0.71 pad 1.68)
  Top 0.254: 55.98,63.82 IC1.8
  Top 0.406: IC3.14 v57.63,63.82 55.98,63.82 | IC11.9 98.01,24.45 99.69,24.45 100.01,24.13 v100.49,23.65
  Bottom 0.406: 99.69,24.45 100.01,24.13
  Bottom 0.61: v57.63,63.82 57.63,62.39 58.74,61.28 68.26,61.28 73.03,57.15 73.03,49.53 92.71,31.43 92.71,26.99 96.2,24.45 99.69,24.45 | 100.01,24.13 v100.49,23.65
QH-165
  Top 0.305: IC7.9 60.96,18.1 61.59,17.46 61.59,12.38 63.82,10.16 63.82,8.89 66.67,6.03 82.39,6.03 91.6,15.24 100.65,15.24 102.08,16.67 102.08,24.77 101.5,25.3 IC11.10
QH-165-DUT
  Top 0.254: 89.29,27.78 IC11.28 | 86.92,28.18 86.84,28.26
  Top 0.305: 89.29,27.78 87.31,27.78 86.92,28.18 86.68,28.42 86.68,36.51 83.19,40.01 64.29,40.01 63.34,40.96 63.34,43.18 61.44,45.09 61.44,50.64 60.96,51.12
  Top 0.406: 60.96,51.12 60.48,51.12 60.33,51.28 59.95,51.28 IC2.9
RESET
  Top 0.254: 99.69,33.34 111.76,33.34 ISP.5
  Top 0.305: IC11.29 93.26,26.91 99.69,33.34
  Top 0.406: R1.1 80.38,27.93 80.38,28.73 | 80.38,28.73 C16.1 82.23,32.02 82.23,33.02 82.2,33.05 U$2.3 | IC11.29 86.92,26.91 85.09,28.73 80.38,28.73
SCK
  Top 0.406: IC11.17 96.46,32.33 98.74,34.61 1602.3 106.68,34.61 108.9,36.83 113.67,36.83 115.25,35.24 115.25,33.02 114.3,32.07 ISP.3
SHLD-165  (via drill 0.71 pad 1.68)
  Top 0.406: IC7.1 v70.48,9.21 79.57,9.21 88.11,17.75 88.11,21.59 89.53,23.01 IC11.1 | IC8.1 69.85,27.62 70.48,26.99 v70.48,25.72
  Bottom 0.61: v70.48,9.21 v70.48,25.72
SHLD-165-DUT  (via drill 0.71 pad 1.68)
  Top 0.254: 89.3,28.57 IC11.27
  Top 0.305: IC2.1 v70.48,42.23 71.6,42.23 73.5,42.23 | 89.3,28.57 87.63,28.57 87.47,28.73 87.47,37.31 82.55,42.23 73.5,42.23 | 73.5,42.23
  Top 0.406: IC3.1 69.85,61.28 70.48,60.64 v70.48,50.48
  Bottom 0.61: v70.48,42.23 v70.48,50.48
VCC  (via drill 0.71 pad 1.68)  (1 unrouted)
  Top 0.254: IC5.9 IC5.10 | IC9.9 IC9.10 | v45.72,63.82 45.82,63.72
  Top 0.305: IC5.9 v53.34,42.23 IC2.16 58.42,42.13 C5.1 | v22.86,3.49 22.86,3.81 | 59.69,9.21 IC7.16
  Top 0.406: IC9.9 v55.24,9.21 59.69,9.21 | v53.98,18.1 IC9.16 | IC3.16 59.69,61.18 C11.1 59.8,59.21 | v63.5,58.26 63.18,58.26 | 94.93,23.08 IC11.6 94.93,22.94 94.93,21.91 95.25,21.59 | IC11.20 94.14,31.67 94.14,30.32 94.3,30.16 95.57,30.16 95.69,30.35 95.69,31.38 IC11.18 95.57,31.69 95.57,36.35 C6.1 | JP6.1 81.76,23.5 80.33,24.92 R1.2 | IC10.4 95.25,58.35 | C6.1 95.52,36.51 | IC11.4 93.26,21.99 93.66,21.59 95.25,21.59 | v92.08,69.06 91.83,68.81 | C6.1 96.52,35.83 96.52,35.56 | IC4.4 31.11,18.1 29.53,19.68 24.13,19.68 21.59,17.14 21.59,9.21 | 21.59,9.21 21.59,5.08 22.86,3.81 | 21.59,9.21 C9.1 | 59.79,26.45 59.79,25.82 v59.69,25.72 | v22.86,3.49 34.29,3.49 34.92,4.13 IC4.14 34.92,8.26 34.68,8.5 arc45 34.5,8.57 30.16,8.57 29.92,8.33 arc45 29.84,8.15 IC4.10 | v95.57,17.14 100.33,17.14 100.97,17.78 100.97,21.27 100.65,21.59 95.25,21.59 | C2.A
  Top 0.61: 45.82,63.72 IC1.14 | IC5.16 52.7,51.12 v53.34,50.48 | IC6.14 48.26,31.43 v48.9,32.7 | 59.79,26.45 IC8.16 | C13.1 52.7,41.59 v53.34,42.23 | 96.52,35.56 96.52,49.53 95.25,50.8 C2.A | QG2.14 38.61,37.34 arc45 38.69,37.52 C15.1 34.4,40.96 arc-45 34.22,41.03 32.07,43.18 32.07,43.5 | v16.83,42.55 17.07,42.79 arc-45 17.25,42.86 31.33,42.86 arc45 31.51,42.94 32.07,43.5 | 32.07,43.5 32.38,43.81 32.38,45.6 arc45 C22.1 32.34,49.85 | 32.34,49.85 32.34,50.55 arc-45 32.41,50.73 IC12.14 | R16.1 29.24,49.77 arc-45 29.41,49.85 32.34,49.85
  Top 0.813: Q2.1 16.51,50.49 arc-45 C28.2 16.51,42.97 arc45 16.58,42.79 v16.83,42.55 | R16.1 C29.2
  Top 1.016: IC10.2 104.36,58.42 LED1.A | 63.18,58.26 62.23,59.21 59.8,59.21
  Top 1.422: IC10.2 IC10.4 95.33,65.81 v92.08,69.06 | C2.A 95.25,58.35 95.18,58.42 ADC_MODE.1 | ADC_MODE.1 ADC_KEY.1 | ADC_MODE.1 DECODER.1
  Bottom 0.406: 55.24,14.92 C8.1 | 55.4,28.1 55.4,28.26 | 59.74,25.67 v59.69,25.72
  Bottom 0.61: v53.34,42.23 53.98,42.23
  Bottom 0.813: ISP.2 108.58,29.53 108.27,29.84 108.58,41.27 106.05,42.86 106.05,55.09 v92.08,69.06
  Bottom 1.016: v53.34,42.23 53.34,48.26 | 53.34,48.26 v53.34,50.48 45.72,58.1 v45.72,63.82 C3.1 45.51,66.67 | v53.98,18.1 55.24,16.83 55.24,14.92 v55.24,9.21 | v63.5,58.26 64.29,57.47 64.29,55.24 57.31,48.26 53.34,48.26 | 55.4,28.26 55.4,32.86 57.94,35.4 57.94,40.48 56.2,42.23 v53.34,42.23 | 48.9,34.92 48.9,40.42 IC5.9 v53.34,42.23 | 48.9,34.92 v48.9,32.7 | 48.9,34.92 C12.1 | v22.86,3.49 52.39,3.49 53.66,4.76 | v55.24,9.21 55.24,6.99 54.93,6.99 | 53.66,4.76 54.61,5.71 54.61,6.67 54.93,6.99 | 54.93,6.99 C7.1 | 55.4,28.1 57.78,25.72 v59.69,25.72 | 59.74,25.67 C10.1 62.87,12.38 60.01,9.53 55.56,9.53 v55.24,9.21 | C14.1 54.29,4.13 53.66,4.76 | 83.03,21.75 JP6.1 | 83.03,21.75 81.92,20.64 C4.1 | 83.03,21.75 90.96,21.75 v95.57,17.14 99.06,13.65 103.19,13.65 110.49,20.95 ISP.2
  Bottom 1.422: v16.83,42.55 31.11,42.55 32.07,42.86 32.07,58.1 44.77,70.8 | v92.08,69.06 87.95,73.18 47.15,73.18 44.77,70.8 | C3.1 45.67,69.9 44.77,70.8

### Text on the board
Top: FreqM-EP V1.40 | S | - | + | digital-toy 2011/5 | SPI | + ISP